# Altium schematic sheet STM32底板.SchDoc
size A4
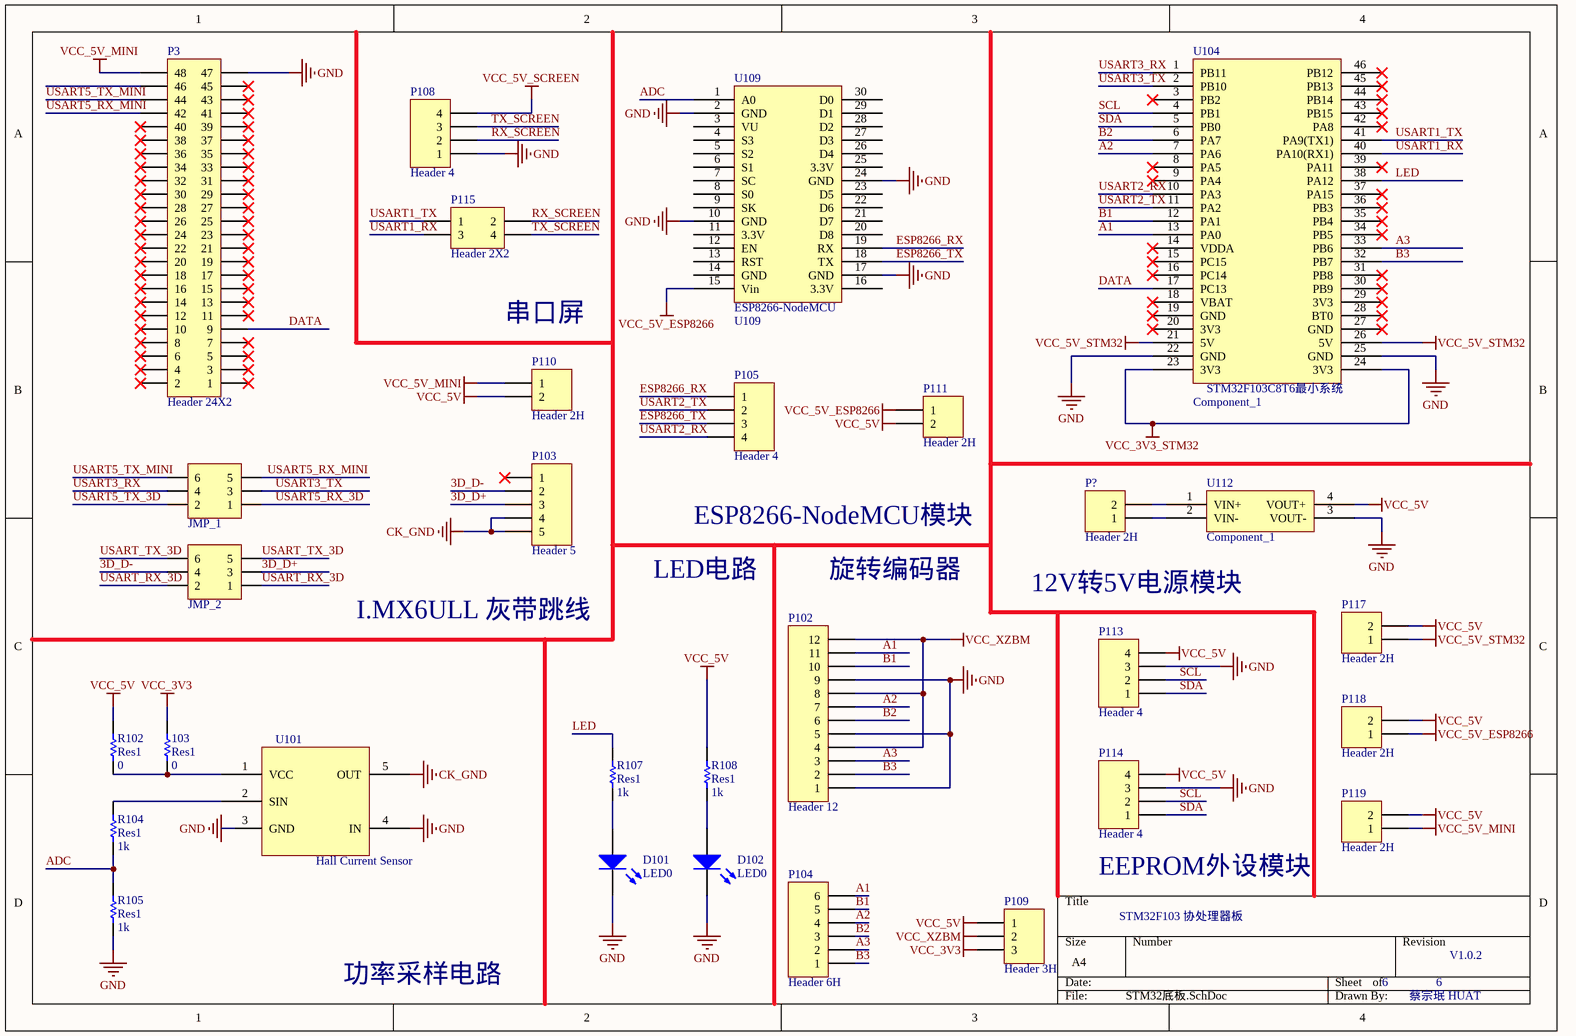
[diagram p0: STM32底板.SchDoc]

## Parts
103  Res1  value 0  [AXIAL-0.3]
?  U101
D101  LED0  [LED-0]
D102  LED0  [LED-0]
JMP_1  RS232/RS485  [HDR-3X2]  (value not drawn)
JMP_2  RS232/RS485  [HDR-3X2]  (value not drawn)
P3  Header 24X2  [HDR2X24]
P102  Header 12  [HDR1X12]
P103  Header 5  [HDR1X5]
P104  Header 6H  [HDR1X6H]
P105  Header 4  [HDR1X4]
P108  Header 4  [HDR1X4]
P109  Header 3H  [HDR1X3H]
P110  Header 2H  [HDR1X2H]
P111  Header 2H  [HDR1X2H]
P113  Header 4  [HDR1X4]
P114  Header 4  [HDR1X4]
P115  Header 2X2  [HDR2X2]
P117  Header 2H  [HDR1X2H]
P118  Header 2H  [HDR1X2H]
P119  Header 2H  [HDR1X2H]
P?  Header 2H  [HDR1X2H]
R102  Res1  value 0  [AXIAL-0.3]
R104  Res1  value 1k  [AXIAL-0.3]
R105  Res1  value 1k  [AXIAL-0.3]
R107  Res1  value 1k  [AXIAL-0.3]
R108  Res1  value 1k  [AXIAL-0.3]
U104  Component_1
U109  U109
U112  Component_1

## Nets
CK_GND: ?.5(OUT) P103.4 P103.5
GND: ?.3(GND) ?.4(IN) D101.2(K) D102.2(K) P3.47 P102.1 P102.5 P102.9 P108.1 P113.3 P114.3 R105.1 U104.22(GND) U104.25(GND) U109.2(GND) U109.10(GND) U109.17(GND) U109.24(GND) U112.3(VOUT-)
VCC_3V3: 103.2 P109.3
VCC_3V3_STM32: U104.23(3V3) U104.24(3V3)
VCC_5V: P109.1 P110.2 P111.2 P113.4 P114.4 P117.2 P118.2 P119.2 R102.2 R108.2 U112.4(VOUT+)
VCC_5V_ESP8266: P111.1 P118.1 U109.15(Vin)
VCC_5V_MINI: P3.48 P110.1 P119.1
VCC_5V_SCREEN: P108.4
VCC_5V_STM32: P117.1 U104.21(5V) U104.26(5V)
VCC_XZBM: P102.4 P102.8 P102.12 P109.2
3D_D+: JMP_2.3 P103.3
3D_D-: JMP_2.4 P103.2
A1: P102.11 P104.6 U104.13(PA0)
A2: P102.7 P104.4 U104.7(PA6)
A3: P102.3 P104.2 U104.33(PB6)
ADC: R104.1 R105.2 U109.1(A0)
B1: P102.10 P104.5 U104.12(PA1)
B2: P102.6 P104.3 U104.6(PA7)
B3: P102.2 P104.1 U104.32(PB7)
DATA: P3.9 U104.17(PC13)
ESP8266_RX: P105.1 U109.19(RX)
ESP8266_TX: P105.3 U109.18(TX)
LED: R107.2 U104.38(PA12)
RX_SCREEN: P108.2 P115.2
SCL: P113.2 P114.2 U104.4(PB1)
SDA: P113.1 P114.1 U104.5(PB0)
TX_SCREEN: P108.3 P115.4
USART1_RX: P115.3 U104.40(PA10(RX1))
USART1_TX: P115.1 U104.41(PA9(TX1))
USART2_RX: P105.4 U104.10(PA3)
USART2_TX: P105.2 U104.11(PA2)
USART3_RX: JMP_1.4 U104.1(PB11)
USART3_TX: JMP_1.3 U104.2(PB10)
USART5_RX_3D: JMP_1.1
USART5_RX_MINI: JMP_1.5 P3.42
USART5_TX_3D: JMP_1.2
USART5_TX_MINI: JMP_1.6 P3.44
USART_RX_3D: JMP_2.1 JMP_2.2
USART_TX_3D: JMP_2.5 JMP_2.6
Net103_1: 103.1 ?.1(VCC) R102.1
Net?_2: ?.2(SIN) R104.2
NetD101_1: D101.1(A) R107.1
NetD102_1: D102.1(A) R108.1
NetP?_1: P?.1 U112.2(VIN-)
NetP?_2: P?.2 U112.1(VIN+)

Not connected (* = marked no-connect by the designer): P3 1* 2* 3* 4* 5* 6* 7* 8* 10* 11* 12* 13* 14* 15* 16* 17* 18* 19* 20* 21* 22* 23* 24* 25* 26* 27* 28* 29* 30* 31* 32* 33* 34* 35* 36* 37* 38* 39* 40* 41* 43* 45* 46; P103 1*; U104 3(PB2)* 8(PA5)* 9(PA4)* 14(VDDA)* 15(PC15)* 16(PC14)* 18(VBAT)* 19(GND)* 20(3V3)* 27(GND)* 28(BT0)* 29(3V3)* 30(PB9)* 31(PB8)* 34(PB5)* 35(PB4)* 36(PB3)* 37(PA15)* 39(PA11)* 42(PA8)* 43(PB15)* 44(PB14)* 45(PB13)* 46(PB12)*; U109 3(VU) 4(S3) 5(S2) 6(S1) 7(SC) 8(S0) 9(SK) 11(3.3V) 12(EN) 13(RST) 14(GND) 16(3.3V) 20(D8) 21(D7) 22(D6) 23(D5) 25(3.3V) 26(D4) 27(D3) 28(D2) 29(D1) 30(D0)

## Notes on the sheet
- 串口屏
- LED电路
- ESP8266-NodeMCU模块
- 旋转编码器
- I.MX6ULL 灰带跳线
- 12V转5V电源模块
- (near P114) EEPROM外设模块
- STM32F103 协处理器板
- 功率采样电路
- 6
- V1.0.2
- 蔡宗珉 HUAT
- (in symbol Component_1) Hall Current Sensor; ESP8266-NodeMCU; STM32F103C8T6最小系统

## Library data of the parts
103 R102 R104 R105 R107 R108 = Res1: Resistor; Published: 8-Jun-2000; LatestRevisionDate: 17-Jul-2002; LatestRevisionNote: Re-released for DXP Platform.; PackageReference: AXIAL-0.3; Publisher: Altium Limited; PackageDescription: Axial Device, Thru-Hole; 2 Leads; 0.3 in Pin Spacing
? U109 = Component_1
D101 D102 = LED0: Typical INFRARED GaAs LED; Published: 8-Jun-2000; LatestRevisionDate: 08-Jul-2005; LatestRevisionNote: Mech Layer 1 removed.; PackageReference: LED-0; Publisher: Altium Limited; PackageDescription: LED; 2 Leads
JMP_1 JMP_2 = Header 3X2: 3*2P接插件; 版权归属: 源创客; BOM名称: 3*2P接插件; 学习资源: www.ooocke.com
P3 = Header 24X2: Header, 24-Pin, Dual row; LatestRevisionDate: 17-Jul-2002; LatestRevisionNote: Re-released for DXP Platform.; Publisher: Altium Limited
P102 = Header 12: Header, 12-Pin; LatestRevisionDate: 17-Jul-2002; LatestRevisionNote: Re-released for DXP Platform.; Publisher: Altium Limited
P103 = Header 5: Header, 5-Pin; LatestRevisionDate: 17-Jul-2002; LatestRevisionNote: Re-released for DXP Platform.; Publisher: Altium Limited
P104 = Header 6H: Header, 6-Pin, Right Angle; LatestRevisionDate: 17-Jul-2002; LatestRevisionNote: Re-released for DXP Platform.; Publisher: Altium Limited
P105 P108 P113 P114 = Header 4: Header, 4-Pin; LatestRevisionDate: 17-Jul-2002; LatestRevisionNote: Re-released for DXP Platform.; Publisher: Altium Limited
P109 = Header 3H: Header, 3-Pin, Right Angle; LatestRevisionDate: 17-Jul-2002; LatestRevisionNote: Re-released for DXP Platform.; Publisher: Altium Limited
P110 P111 P117-P119 P? = Header 2H: Header, 2-Pin, Right Angle; LatestRevisionDate: 17-Jul-2002; LatestRevisionNote: Re-released for DXP Platform.; Publisher: Altium Limited
P115 = Header 2X2: Header, 2-Pin, Dual row; LatestRevisionDate: 17-Jul-2002; LatestRevisionNote: Re-released for DXP Platform.; Publisher: Altium Limited